# EAGLE schematic supply_test (EAGLE 6.5.0)

## Sheet 1 of 2: AC-DC Power Supply
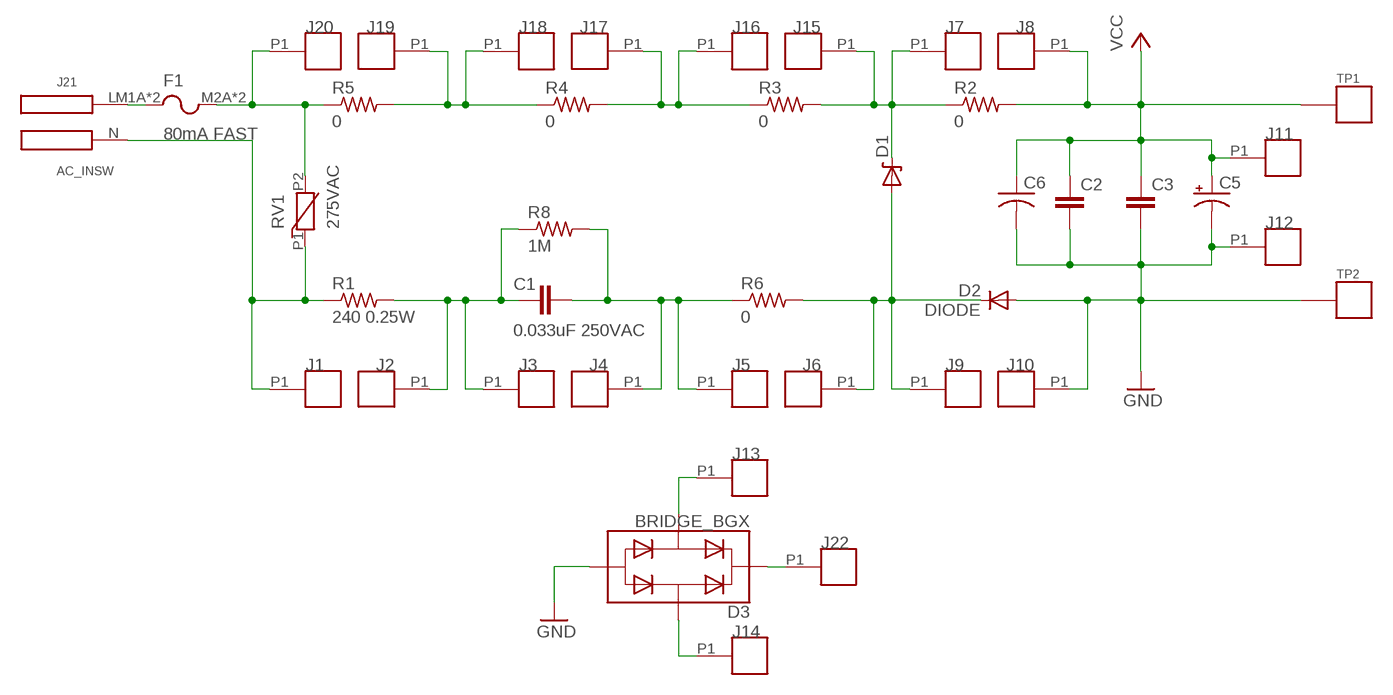
[diagram p0: schematic, sheet 1]

### Parts
C1  0.033uF 250VAC  C-EUC2220K  [C2220K]
C2  C-EUC0805  [C0805]
C3  C-EUC0603  [C0603]
C5  CAP_POL1206  [EIA3216]
C6  C-USC1210  [C1210]
D1  ZENERBZT52  [BZT52]
D2  DIODE  [BAS521]
D3  BRIDGE_BGX  [TO-253-4]
F1  80mA FAST  FUSE  [FUSE]
J1  SOCKET  [SOCKET_1MM]
J2  SOCKET  [SOCKET_1MM]
J3  SOCKET  [SOCKET_1MM]
J4  SOCKET  [SOCKET_1MM]
J5  SOCKET  [SOCKET_1MM]
J6  SOCKET  [SOCKET_1MM]
J7  SOCKET  [SOCKET_1MM]
J8  SOCKET  [SOCKET_1MM]
J9  SOCKET  [SOCKET_1MM]
J10  SOCKET  [SOCKET_1MM]
J11  SOCKET  [SOCKET_1MM]
J12  SOCKET  [SOCKET_1MM]
J13  SOCKET  [SOCKET_1MM]
J14  SOCKET  [SOCKET_1MM]
J15  SOCKET  [SOCKET_1MM]
J16  SOCKET  [SOCKET_1MM]
J17  SOCKET  [SOCKET_1MM]
J18  SOCKET  [SOCKET_1MM]
J19  SOCKET  [SOCKET_1MM]
J20  SOCKET  [SOCKET_1MM]
J21  AC_INSW  [AC_DC21]
J22  SOCKET  [SOCKET_1MM]
R1  240 0.25W  R-US_R0603  [R0603]
R2  0  R-US_R0603  [R0603]
R3  0  R-US_R0603  [R0603]
R4  0  R-US_R0603  [R0603]
R5  0  R-US_R0603  [R0603]
R6  0  R-US_R0603  [R0603]
R8  1M  R-US_R0603  [R0603]
RV1  275VAC  MOV_CU4032  [MOV_4032]
TP1  TP_STD  [TP]
TP2  TP_STD  [TP]

### Nets
GND: C2.2 C3.2 C5.C(-) C6.2 D2.A D3.P3 J10.P1 J12.P1 TP2.P$1 ; also sheet 2
N$1: C1.2 J2.P1 J3.P1 R1.2 R8.1
N$2: J1.P1 J21.N R1.1 RV1.P1
N$3: C1.1 J4.P1 J5.P1 R6.1 R8.2
N$4: D1.A D2.C J6.P1 J9.P1 R6.2
N$5: D1.C J7.P1 J15.P1 R2.1 R3.2
N$6: D3.P2 J13.P1
N$7: D3.P1 J22.P1
N$8: D3.P4 J14.P1
N$11: F1.M1A(P1) F1.M1B(P1) J21.L(P)
N$12: J16.P1 J17.P1 R3.1 R4.2
N$14: F1.M2A(P2) F1.M2B(P2) J20.P1 R5.1 RV1.P2
N$15: J18.P1 J19.P1 R4.1 R5.2
VCC: C2.1 C3.1 C5.A(+) C6.1 J8.P1 J11.P1 R2.2 TP1.P$1 ; also sheet 2

## Sheet 2 of 2: Load Supply Regulation
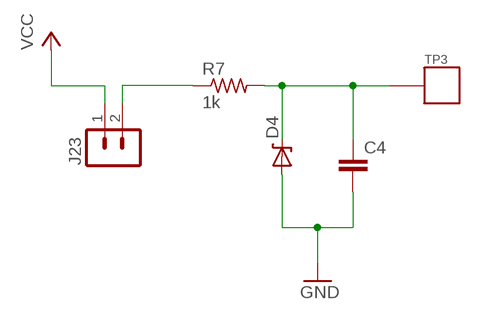
[diagram p1: schematic, sheet 2]

### Parts
C4  C-EUC0603  [C0603]
D4  ZENERBZT52  [BZT52]
J23  MA02-1STR  [MA02-1]
R7  1k  R-US_R0603  [R0603]
TP3  TP_STD  [TP]

### Nets
GND: C4.2 D4.A ; also sheet 1
N$9: J23.2 R7.1
N$10: C4.1 D4.C R7.2 TP3.P$1
VCC: J23.1 ; also sheet 1

## Library data of the parts
C1 = rcl:C-EU: CAPACITOR, European symbol; DIGIKEY: 490-4238-1-ND
C2 = rcl:C-EU: CAPACITOR, European symbol; DIGIKEY: 445-8238-1-ND
C3 = rcl:C-EU: CAPACITOR, European symbol; DIGIKEY: 718-1672-1-ND
C4 = rcl:C-EU: CAPACITOR, European symbol; DIGIKEY: 445-8028-1-ND
C5 = SparkFun-Passives:CAP_POL: Capacitor Polarized These are standard SMD and PTH capacitors. Normally 10uF, 47uF, and 100uF in electrolytic and tantalum varieties. Always verify the external diameter of the through hole cap, it varies with capacity, voltage, and manufacturer. The EIA devices should be standard.; DIGIKEY: NP
C6 = rcl:C-US: CAPACITOR, American symbol; DIGIKEY: 478-8408-1-ND
D1 = powerfilm:ZENER; DIGIKEY: BZT52C3V3T-7DICT-ND; DIGIKEY_2: BZT585B5V1T-7DICT-ND; DIGIKEY_3: BZT585B6V8T-7DICT-ND
D2 = powerfilm:DIODE; DIGIKEY: BAS521-7DICT-ND
D3 = powerfilm:BRIDGE_BGX; DIGIKEY: BGX50AINCT-ND
D4 = powerfilm:ZENER; DIGIKEY: BZT52C3V3T-7DICT-ND
F1 = powerfilm:FUSE; DIGIKEY: 507-1218-ND; DIGIKEY_2: 507-1415-ND; DIGIKEY_3: 507-1415-ND
J1-J20 J22 = powerfilm:SOCKET; DIGIKEY: ED90076-ND
J21 = powerfilm:AC_IN; DIGIKEY: 486-1076-ND; DIGIKEY_2: AE9888-ND
J23 = con-lstb:MA02-1; DIGIKEY: 609-4434-ND
R1 = rcl:R-US_: RESISTOR, American symbol; DIGIKEY: RHM240DCT-ND
R2-R6 = rcl:R-US_: RESISTOR, American symbol; DIGIKEY: P0.0GCT-ND
R7 = rcl:R-US_: RESISTOR, American symbol; DIGIKEY: P1.0KGCT-ND
R8 = rcl:R-US_: RESISTOR, American symbol; DIGIKEY: MCT0603-1.00M-CFCT-ND
RV1 = powerfilm:MOV_CU4032; DIGIKEY: 495-2390-1-ND
TP1 TP3 = skyspecs:TP; DIGIKEY: 5000K-ND
TP2 = skyspecs:TP; DIGIKEY: 5001K-ND